# EAGLE design rect (EAGLE 6.3)
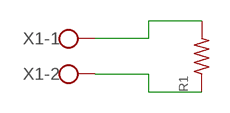
[diagram p0: schematic, sheet 1]

## Parts
R1  RR1206  [R1206]
X1  W237-02P  [W237-132]

## Nets
GND: R1.2 X1.1
N$1: R1.1 X1.2

## Library data of the parts
R1 = 00inv Passives:R*
X1 = 00inv Connectors:W237-02P: WAGO SREW CLAMP

## Board
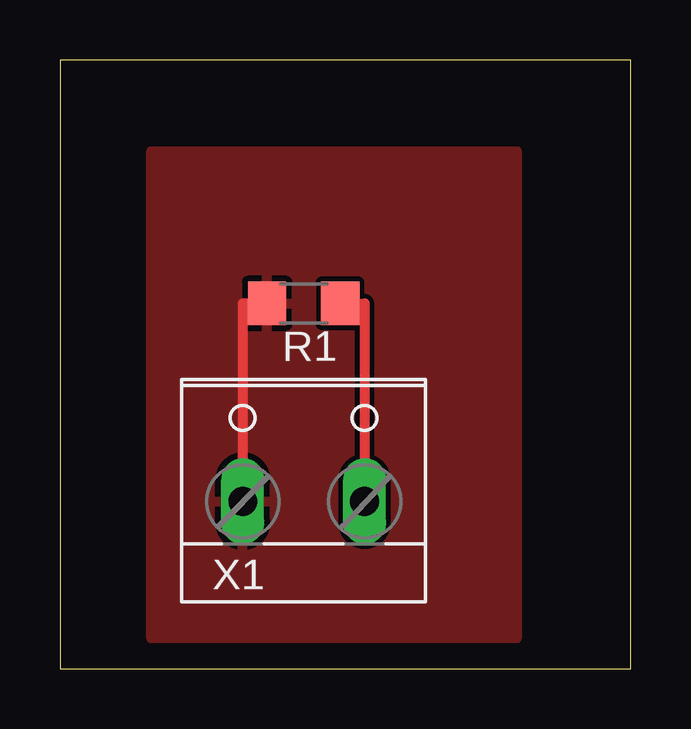
[diagram p1: board, top side]

Size 23.8 x 25.39 mm. Coordinates in mm from the lower left corner, seen from the top.
Outline: 0,0 23.8,0 23.8,25.39 0,25.39 0,0
Copper layers (1*16): Top 0.035mm / dielectric 1.5mm / Bottom 0.035mm
Design rules "default": minimum track width 10mil, minimum drill 24mil, track to track 8mil, track to pad 8mil, pad to pad 8mil, via to via 8mil, smd to smd 8mil, copper to edge 40mil, drill to drill 8mil, minimum pad ring 10mil, minimum via ring 8mil, stop-mask expansion 4mil, vias tented up to drill 0mil, thermal gap 10mil

### Footprints (pad centres in the part's own frame; a part is rotated, then mirrored left to right if it is on the bottom)
R1206 = smd 1.6 x 1.803: 1 -1.524,0; 2 1.524,0
W237-132 = drill 1.194 long: 1 -2.54,-0.635; 2 2.54,-0.635

### Placement (x,y rotation side)
R1  10.16,15.24 180 top
X1  10.16,7.62 0 top

### Tracks (layer width: path | path; a pad name or v marks a point on that pad's centre or on a via)
GND
  Top 0.406: R1.2 7.62,15.24 X1.1
  pour Top: 3.81,21.59 19.05,21.59 19.05,1.27 3.81,1.27
N$1
  Top 0.406: R1.1 12.7,15.24 X1.2